# Altium schematic sheet MotionBoard.SchDoc
size A3; SheetNumber: 1; SheetTotal: 1
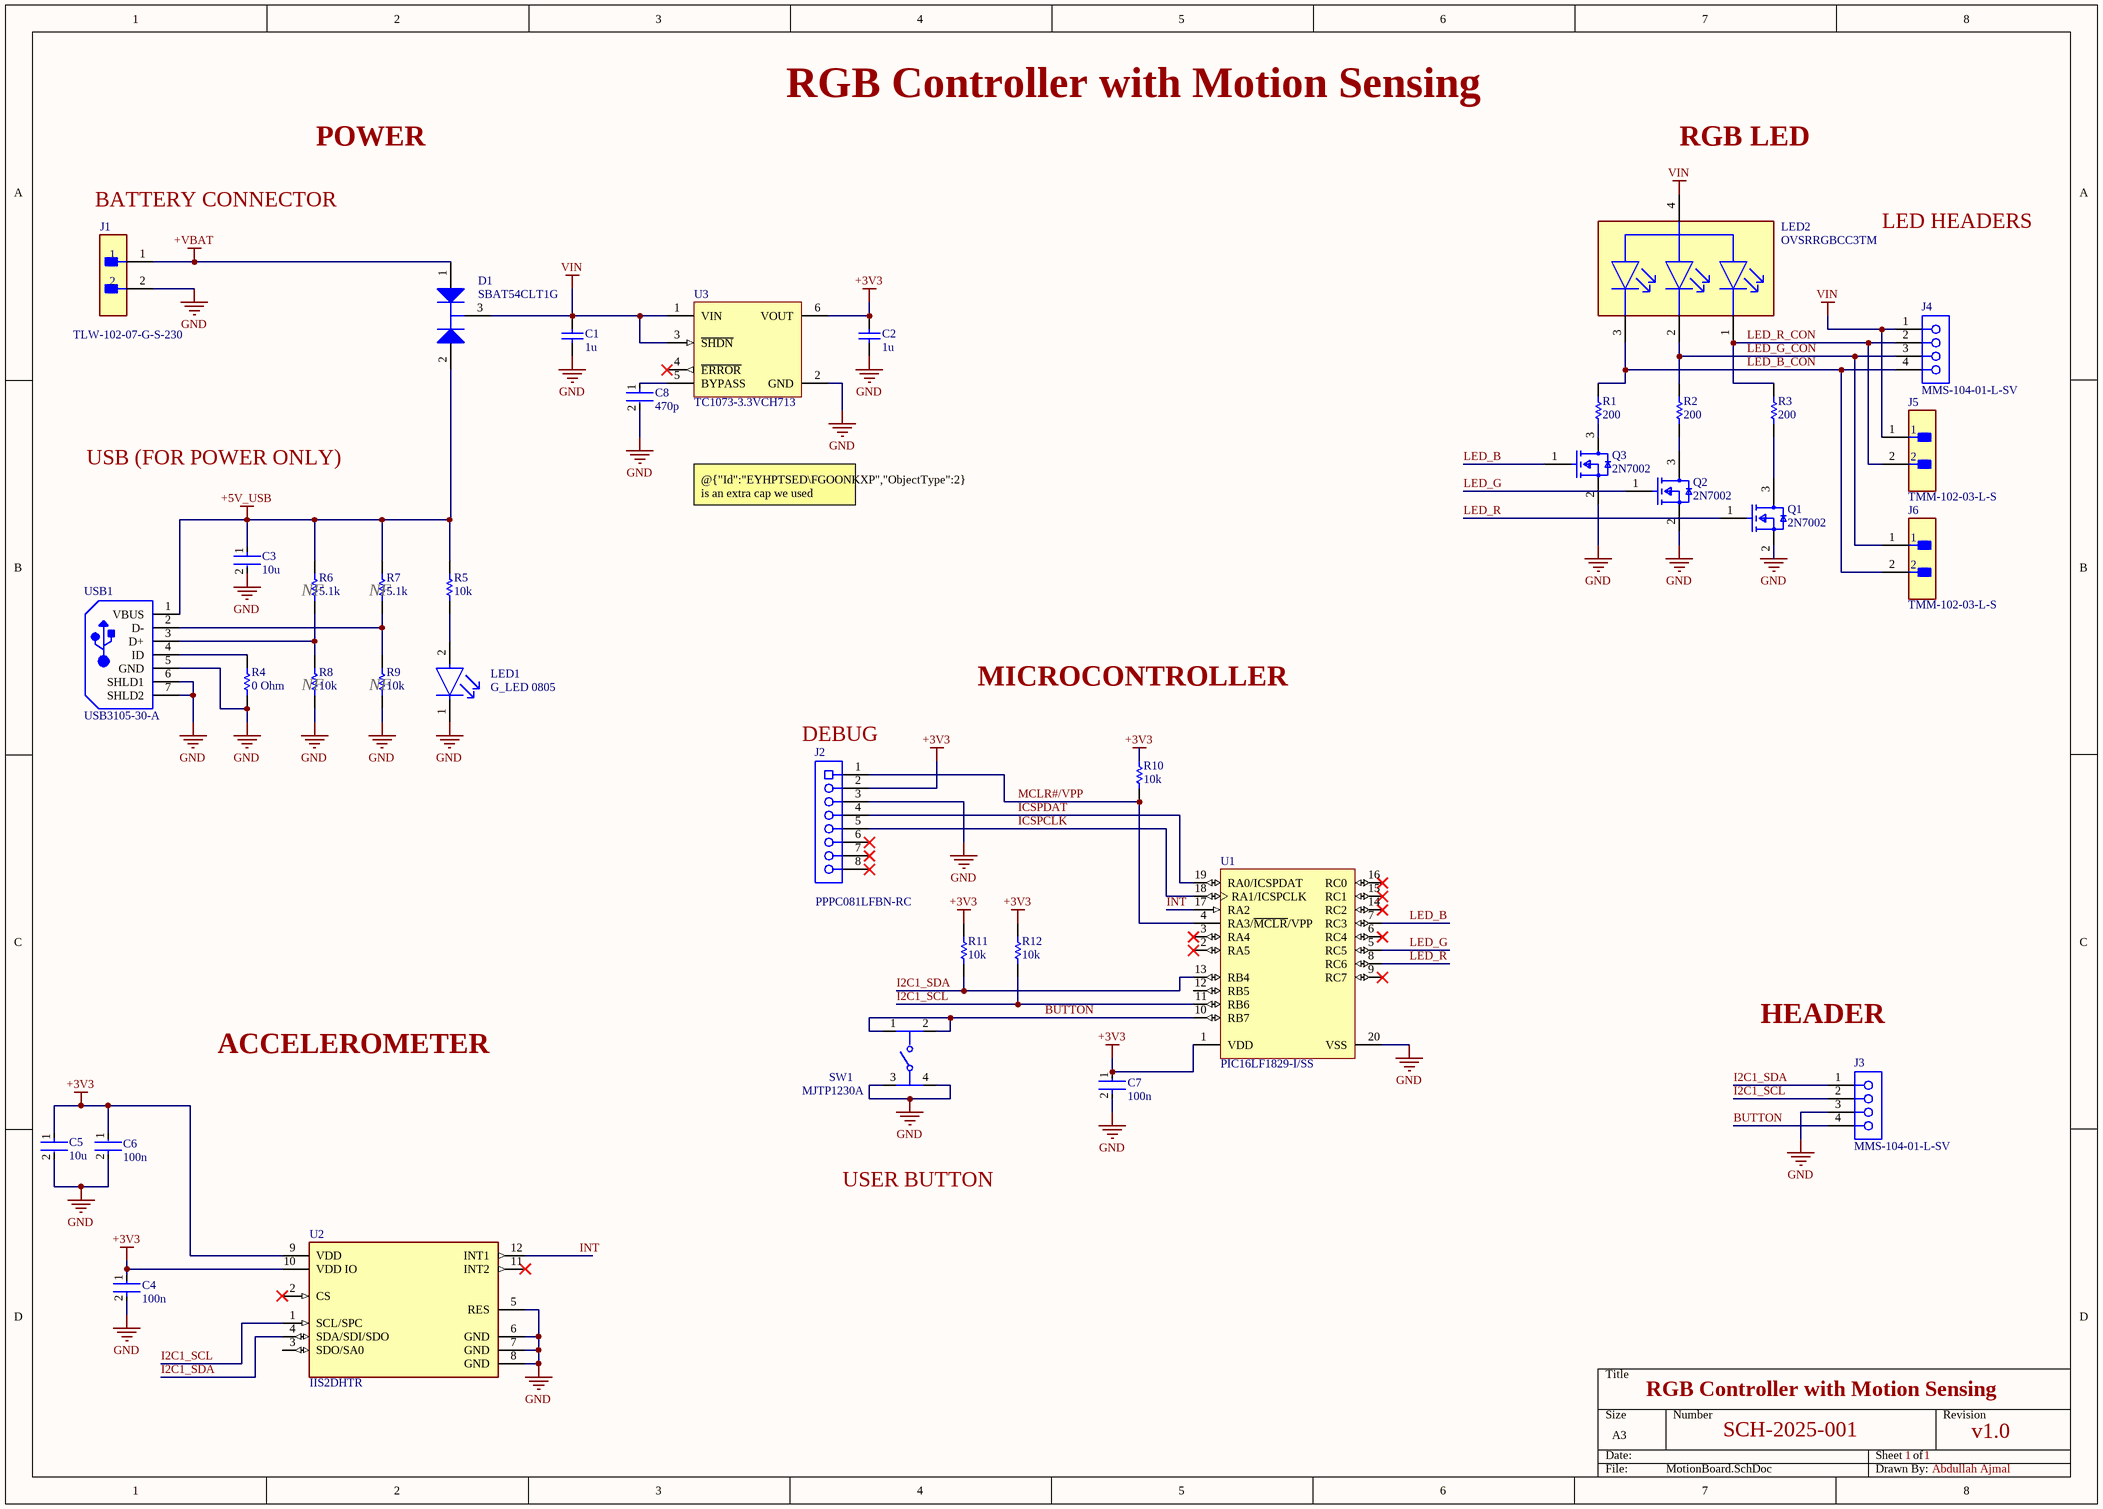
[diagram p0: MotionBoard.SchDoc]

## Parts
C1  1u  [CAPC2013X140X50NL20T25]
C2  1u  [CAPC2013X140X50NL20T25]
C3  10u  [FP-GRM188-0_2-MFG]
C4  100n  [FP-AC1210-0_85-MFG]
C5  10u  [FP-GRM188-0_2-MFG]
C6  100n  [FP-AC1210-0_85-MFG]
C7  100n  [FP-AC1210-0_85-MFG]
C8  470p  [FP-C0402-BB-MFG]
D1  SBAT54CLT1G  [ONSC-SOT-23-3-318-08_V]
J1  TLW-102-07-G-S-230  [FP-MTLW-102-07-G-S-230-MFG]
J2  PPPC081LFBN-RC  [SLIN-PPPC081LFBN-RC_V]
J3  MMS-104-01-L-SV  [SMTC-MMS-104-01-X-SV]
J4  MMS-104-01-L-SV  [SMTC-MMS-104-01-X-SV]
J5  TMM-102-03-L-S  [FP-TMM-102-03-L-S-MFG]
J6  TMM-102-03-L-S  [FP-TMM-102-03-L-S-MFG]
LED1  G_LED 0805  [FP-LG_R971-MFG]
LED2  OVSRRGBCC3TM  [FP-OVSRRGBCC3TM-MFG]
Q1  2N7002  [FP-PG-SOT23-3-MFG]
Q2  2N7002  [FP-PG-SOT23-3-MFG]
Q3  2N7002  [FP-PG-SOT23-3-MFG]
R1  200  [RESC3225X60X45ML20T20]
R2  200  [RESC3225X60X45ML20T20]
R3  200  [RESC3225X60X45ML20T20]
R4  0 Ohm  [RESC3116X65X45LL15T20]
R5  10k  [RESC1005X40X20NL05T10]
R6  5.1k  [RESC1005X35X20LL05T10]
R7  5.1k  [RESC1005X35X20LL05T10]
R8  10k  [RESC1005X40X20NL05T10]
R9  10k  [RESC1005X40X20NL05T10]
R10  10k  [RESC1005X40X20NL05T10]
R11  10k  [RESC1005X40X20NL05T10]
R12  10k  [RESC1005X40X20NL05T10]
SW1  MJTP1230A  [FP-MJTP1230A-MFG]
U1  PIC16LF1829-I/SS  [MCHP-SSOP-SS20_L]
U2  IIS2DHTR  [FP-LGA-12-8365767-MFG]
U3  TC1073-3.3VCH713  [SOT-23-CH6_M]
USB1  USB3105-30-A  [GCT-USB3105-30-A_V]

## Nets
+3V3: C2.2 C4.1 C5.1 C6.1 C7.1 J2.2 R10.2 R11.2 R12.2 U1.1(VDD) U2.9(VDD) U2.10(VDD_IO) U3.6(VOUT)
+5V_USB: C3.1 D1.2(A2) R5.2 R6.2 R7.2 USB1.1(VBUS)
+VBAT: D1.1(A1) J1.1
GND: C1.1 C2.1 C3.2 C4.2 C5.2 C6.2 C7.2 C8.2 J1.2 J2.3 J3.3 LED1.1(C) Q1.2(source) Q2.2(source) Q3.2(source) R4.1 R8.1 R9.1 SW1.3 SW1.4 U1.20(VSS) U2.5(RES) U2.6(GND) U2.7(GND) U2.8(GND) U3.2(GND) USB1.5(GND) USB1.6(SHLD1) USB1.7(SHLD2)
VIN: C1.2 D1.3(K) J4.1 J5.1 LED2.4(ANODE) U3.1(VIN) U3.3(~{SHDN})
BUTTON: J3.4 SW1.1 SW1.2 U1.10(RB7)
I2C1_SCL: J3.2 R12.1 U1.11(RB6) U2.1(SCL/SPC)
I2C1_SDA: J3.1 R11.1 U1.13(RB4) U2.4(SDA/SDI/SDO)
ICSPCLK: J2.5 U1.18(RA1/ICSPCLK)
ICSPDAT: J2.4 U1.19(RA0/ICSPDAT)
INT: U1.17(RA2) U2.12(INT1)
LED_B: Q3.1(gate) U1.7(RC3)
LED_B_CON: J4.4 J6.2 LED2.3(B) R1.2
LED_G: Q2.1(gate) U1.5(RC5)
LED_G_CON: J4.3 J6.1 LED2.2(G) R2.2
LED_R: Q1.1(gate) U1.8(RC6)
LED_R_CON: J4.2 J5.2 LED2.1(R) R3.2
MCLR#/VPP: J2.1 R10.1 U1.4(RA3/~{MCLR}/VPP)
NetC8_1: C8.1 U3.5(BYPASS)
NetLED1_2: LED1.2(A) R5.1
NetQ1_3: Q1.3(drain) R3.1
NetQ2_3: Q2.3(drain) R2.1
NetQ3_3: Q3.3(drain) R1.1
NetR4_2: R4.2 USB1.4(ID)
NetR6_1: R6.1 R8.2 USB1.3(D+)
NetR7_1: R7.1 R9.2 USB1.2(D-)

Not connected (* = marked no-connect by the designer): J2 6* 7* 8*; U1 2(RA5)* 3(RA4)* 6(RC4)* 9(RC7)* 12(RB5) 14(RC2)* 15(RC1)* 16(RC0)*; U2 2(CS)* 3(SDO/SA0) 11(INT2)*; U3 4(~{ERROR})*

## Notes on the sheet
- RGB Controller with Motion Sensing
- POWER
- RGB LED
- (near J1) BATTERY CONNECTOR
- LED HEADERS
- USB (FOR POWER ONLY)
- @{"Id":"EYHPTSED\FGOONKXP","ObjectType":2} is an extra cap we used
  KEEP NOTE
- (near R6) NF
- (near R7) NF
- (near R8) NF
- (near R9) NF
- MICROCONTROLLER
- (near J2) DEBUG
- ACCELEROMETER
- HEADER
- USER BUTTON
- SCH-2025-001
- 1
- v1.0
- Abdullah Ajmal

## Library data of the parts
C1 C2 = CMP-2007-03237-1: Part Number: C0805C105M4PACTU; Manufacturer: Kemet
C3 C5 = CMP-06035-009669-1: Chip Multilayer Ceramic Capacitors for General Purpose, 0603, 10uF, X5R, 15%, 20%, 16V / GRM188R61C106MA73J; Width: 800um; Capacitance: 10uF; Tolerance: 20%; Thickness: 800um; Dielectric: X5R; Length: 1.6mm; Voltage Rating (DC): 16V
C4 C6 C7 = CMP-03422-000642-1: CAP CER 0.1UF 100V X7R 1210 / AC1210KKX7R0BB104; Manufacturer: Yageo; Automotive Grade: Grade 1; Capacitance: 100 nF; Material: Ceramic; Value: 100 nF; Temperature Coefficient: 15%; Tolerance: 0.1; Automotive: Yes; ComponentLink2Description: Datasheet; Device Class L2: Capacitors; Height: 0.95mm; Manufacturer Part Number: AC1210KKX7R0BB104; Temperature: -55°C to +125°C; Voltage Rating: 100 V; Device Class L1: Passive Components; ComponentLink2URL: http://www.yageo.com/documents/recent/UPY-AC_NP0X7R_16V-to-630V_12.pdf; Lead Free: Yes; Category: Cap; Temperature Range High: +125°C; RoHS: TRUE; Digikey Description: CAP CER 0.1UF 100V X7R 1210; Temperature Range Low: -55°C; Octopart: https://octopart.com/ac1210kkx7r0bb104-yageo-78873719; Device Class L3: Ceramic Capacitors; Ipc Land Pattern Name: CAPC320250X85; Package: AC1210-0.85; Footprint Url: http://www.yageo.com/exep/pages/download/literatures/UPY-C_GEN_24.pdf; Temperature Characteristic: X7R
C8 = CMP-03020-005716-2: C0402 470 pF C0G 10.00% 16 V; Manufacturer: Kemet; Manufacturer Part Number: C0402C471K4GACAUTO; Voltage Rating: 16 V; Material: Ceramic; Tolerance: 0.1; Capacitance: 470 pF; Temperature Coefficient: 15%; Value: 470 pF; Height: 0.55mm; Ipc Land Pattern Name: CAPC10050X50; Temperature Range High: +125°C; Lead Free: Yes; Temperature: -55°C to +125°C; Device Class L3: Ceramic Capacitors; Category: Cap; Temperature Characteristic: C0G; Automotive: No; Temperature Range Low: -55°C; RoHS: TRUE; Package: C0402-BB; Octopart: https://octopart.com/c0402c471k4gacauto-kemet-48652786; ComponentLink2URL: https://content.kemet.com/datasheets/KEM_C1002_X7R_SMD.pdf; Device Class L1: Passive Components; Device Class L2: Capacitors; ComponentLink2Description: Datasheet
D1 = CMP-1055-00546-1: Dual Common Cathode Schottky Barrier Diodes, 3-Pin SOT-23, Pb-Free, Tape and Reel; Manufacturer: On Semiconductor; IFSM Max (A): 0.6; trr Max (ns): 5; DatasheetVersion: Rev. 8; PackageReference: SOT-23-3-318-08; ComponentLink2Description: Datasheet; ComponentLink2URL: http://www.onsemi.cn/pub_link/Collateral/BAT54CLT1-D.PDF; PartNumber: SBAT54CLT1G; Mounting Technology: Surface Mount; Configuration: Common Cathode; PackageDescription: 3-Pin Small Outline Transistor, Body 2.92 x 1.3 mm, Pitch 0.95 mm; RoHS: TRUE; ComponentLink3Description: Package Specification; ComponentLink3URL: http://www.onsemi.cn/pub_link/Collateral/318-08.PDF; Packing: Tape and Reel; PackageVersion: Rev. AP, 11/2009; ComponentLink1Description: Manufacturer URL; ComponentLink1URL: http://www.onsemi.com/
J1 = CMP-02766-001053-1: CONN HEADER VERT 2POS 2.54 / MMMTLW-102-07-G-S-230; Max Current Rating: 3A; Pitch: 2.54mm; Number of Contacts: 2; Gender: Male; Housing Color: Black; Housing Material: Polymer; Radiation Hardening: No; Min Operating Temperature: -55°C; Contact Plating: Gold; Termination: Solder; Number of Rows: 1; Max Operating Temperature: 125°C; Contact Material: Bronze; Depth: 2.48mm; Length: 5.08mm; Orientation: Straight; Packaging: Bulk
J2 = CMP-002-00028-2: Female Header, Pitch 2.54 mm, 1 x 8 Position, Height 8.5 mm, Tail Length 3.2 mm, -40 to 105 degC, RoHS, Bulk; Manufacturer: Sullins; Package Reference: PPPC081LFBN-RC; Connector Type: Header; Datasheet Version: Jan-15; Package Description: Female Header, Pitch 2.54 mm, 1 x 8 Position, Height 8.5 mm, Tail Length 3.2 mm; RoHS Compliant: Unknown; Max Operating Temperature: 105°C; Case/Package: PPPC081LFBN-RC; Min Operating Temperature: -40°C; Datasheet URL: http://sullinscorp.com/catalogs/101_PAGE114-115_.100_FEMALE_HDR.pdf; Gender: Female; Mounting Technology: TH
J3 J4 = CMP-1022-00067-1: Tiger Claw(TM) Socket Strip, Through-hole, Vertical, -55 to 125 degC, 2 mm Pitch, 4-Pin, Female, RoHS; Manufacturer: Samtec; Pitch: 2 mm; Orientation: Vertical; Mounting Technology: Through-hole; PackageVersion: AO, 2/1993; PartNumber: MMS-104-01-L-SV; ComponentLink1URL: http://www.samtec.com; ComponentLink3Description: Package Specification; ComponentLink2Description: Datasheet; PackageDescription: 2mm Through Hole Box Connector Strip Assembly; RoHS: True; DatasheetVersion: F-214; Temperature Range: -55 to 125 degC; ComponentLink3URL: http://www.samtec.com/documents/webfiles/cpdf/MMS-1XX-01-XXX-XX-XXX-MKT1.pdf; ComponentLink1Description: Manufacturer URL; ComponentLink2URL: http://www.samtec.com/documents/webfiles/pdf/MMS.PDF; PackageReference: MMS-104-01-X-SV
J5 J6 = CMP-02766-001502-1: CONN HEADER 2POS SNGL 2MM T/H; Gender: Male; Max Voltage Rating (AC): 500V; Number of Positions: 2; Max Current Rating: 3.9A; Insulation Material: Polymer; Lead Free: Lead Free; Termination: Solder; Contact Type: Male Pin; Number of Rows: 1; Min Operating Temperature: -55°C; Orientation: Straight; Insulation Color: Black; Depth: 1.97mm; Contact Plating: Gold; Housing Material: Polymer; Max Operating Temperature: 125°C; Fastening Type: Pull; Housing Color: Black; Series: TMM; Pitch: 2mm; Packaging: Bulk; Number of Contacts: 2; Radiation Hardening: No; Contact Material: Bronze; RoHS Compliant: Yes; Connector Type: Header; Length: 4mm; Contact Shape: Square; Mount: Through Hole; Package Quantity: 1; Color: Black; Contact Finish - Mating: GOLD; Contact Mating Length: 0.157inch; REACH SVHC: No SVHC
LED1 = CMP-62016-000039-1: LED GREEN DIFFUSED 0805 SMD / Q62702P5179; Test Current: 20mA; Power Dissipation: 65mW; Number of LEDs: 1; Viewing Angle: 160°; Lens Color: White; Lens Size: 1.25mm; Forward Voltage: 2.2V; Reverse Voltage: 12V; Forward Current: 25mA; Luminous Intensity: 45mcd; Luminous Flux: 0.1lm; Dominant Wavelength: 570nm; Min Operating Temperature: -30°C; Packaging: Tape and Reel; Radiation Hardening: No; Number of Pins: 2; Case Code (Imperial): 0805; Lens Style: Diffused; Mount: Surface Mount; Package Quantity: 1; Case Code (Metric): 2012; Color: Green; Case/Package: 0805; Width: 1.25mm; Illumination Color: Green; Lens Transparency: Diffused; Max Operating Temperature: 85°C; Number of Elements: 1; Depth: 1.35mm; Height: 0.9mm; Length: 2.1mm
LED2 = CMP-70659-000001-1: LED RGB DIFFUSED 1204 SMD; Color: Blue; Dominant Wavelength: 475nm; Lens Style: Dome; Luminous Intensity: 200mcd; Forward Voltage: 3.3V; Viewing Angle: 150°; Test Current: 20mA; Lens Color: White; Width: 1mm; Series: -; Case/Package: SMD/SMT; Packaging: Cut Tape; RoHS Compliant: Yes; Lens Transparency: Diffused; REACH SVHC: No SVHC; Lead Free: Lead Free; Length: 3.2mm; Height: 1.5mm; Mount: Surface Mount
Q1-Q3 = CMP-32901-000180-1: MOSFET N-CH 60V 0.3A SOT23 / 2N7002H6327XTSA2; Rise Time: 3.3ns; Input Capacitance: 20pF; Rds On Max: 3R; Gate to Source Voltage (Vgs): 20V; Continuous Drain Current (ID): 300mA; Max Power Dissipation: 500mW; Packaging: Tape and Reel; Mount: Surface Mount; Case/Package: SOT-23; Drain to Source Voltage (Vdss): 60V; Min Operating Temperature: -55°C; Halogen Free: Halogen Free; Max Dual Supply Voltage: 60V; Number of Pins: 3; Lead Free: Lead Free; Max Operating Temperature: 150°C
R1-R3 = CMP-2005-00653-1: CRCW1210200RJNTA; Manufacturer: Vishay Dale; Part Number: CRCW1210200RJNTA
R4 = CMP-2000-07493-1: Chip Resistor, 0 Ohm, +/- 0%, 0.25 W, -55 to 155 degC, 1206 (3216 Metric), RoHS, Tape and Reel / CRG1206ZR; Manufacturer: TE Connectivity; Number of Resistors: 1; Power Rating: 250mW; Resistance: 0mOhm; Temperature Coefficient: 100ppm\/degreesC; Voltage Rating: 200V; Case\/Package: 1206; Max Operating Temperature: 125degC; RoHSCompliant: true; Case Code (Imperial): 1206; Mounting Technology: SurfaceMount; ELV: Compliant; Min Operating Temperature: -55degC; Number of Terminations: 2; Tolerance: 0%; Package Quantity: 5000; Depth: 1.55mm; Height: 0.55mm; Datasheet URL: http://www.te.com/commerce/DocumentDelivery/DDEController?Action=showdoc&DocId=Customer+Drawing%7F1623693%7FBA%7Fpdf%7FEnglish%7FENG_CD_1623693_BA.pdf%7F1623693-1; Manufacturer URL: http://www.te.com/; Package Reference: RESC3116X65X45L15T20; Termination: Solder; Datasheet Version: Rev. BA, 12/2009; Package Description: 2-Pin Chip Resistor, Body 3.1 x 1.55 mm; Length: 3.1mm; Case Code (Metric): 3216; Radiation Hardening: No; Packaging: TapeandReel; Weight: 0.000571oz; Composition: ThickFilm; Width: 1.55mm; Mount: SurfaceMount
R5 R8-R12 = CMP-2002-01682-1: TNPW040210K0DEED; Manufacturer: Vishay BCcomponents; Part Number: TNPW040210K0DEED
R6 R7 = CMP-2002-03342-1: CPF0402B5K1E1; Manufacturer: TE Connectivity / AMP; Part Number: CPF0402B5K1E1
SW1 = CMP-47024-000004-1: SWITCH TACTILE SPST-NO 0.05A 12V; Mechanical Life: 100000Cycles; Throw Configuration: SPST; Actuator Length: 1.4mm; Switch Travel: 0.25mm; Actuator Color: Black; Operating Force: 160gf; Contact Resistance: 100mR; Actuator Type: Standard; Switch Function: Off-Mom; Actuator Material: Thermoplastic; Illumination Type: Non-Illuminated; Current Rating: 50mA; Min Operating Temperature: -20°C; Series: MJTP; Electrical Life: 100000Cycles; Mount: Through Hole; Packaging: Bulk; Color: Black; Package Quantity: 2000; Voltage Rating (DC): 12V; REACH SVHC: No SVHC; Orientation: Straight; Termination: PC Pin; Contact Material: Bronze; RoHS Compliant: Yes; Max Voltage Rating (DC): 12V; Max Operating Temperature: 70°C; Contact Plating: Silver
U1 = CMP-0115-02781-1: Flash Microcontroller with XLP Technology, 32 MHz, 17 I/O, -40 to 85 degC, 20-pin SSOP (SS20), Tube; Manufacturer: Microchip; Program Memory KWords: 8; Max. CPU Speed MHz: 32; # of A/D Channels: 12; Digital Communication: 1 -A/E/USART, 2 -MSSP(SPI/I2C); Internal Oscillator: 32 MHz, 31 kHz; Program Memory KBytes: 14; Timers: 4 - 8-bit, 1 - 16-bit, 0 - 32-bit; EEPROM Data Memory (bytes): 256; Operation Voltage Range: 1.8V - 3.6V; I/O Pins: 17; RAM: 1024; Mounting Technology: Surface Mount; PackageReference: SSOP-SS20; PartNumber: PIC16LF1829-I/SS; ComponentLink3URL: Product URL:http://www.microchip.com/wwwproducts/Devices.aspx?dDocName=en546919; ComponentLink1Description: Datasheet; DatasheetVersion: Rev. C; ComponentLink2Description: Package Specification; Memory Type: Flash; ComponentLink1URL: http://ww1.microchip.com/downloads/en/DeviceDoc/41440C.pdf; PackageDescription: 20-Lead Plastic Shrink Small Outline, 5.3 x 7.2 mm Body, 0.65 mm Pitch; Packing: TUBE; ComponentLink3Description: URL Link1; PackageVersion: C04-072B, 12/2012; ComponentLink2URL: http://www.microchip.com/stellent/groups/techpub_sg/documents/packagingspec/en012702.pdf
U2 = CMP-12175-000008-1: ACCEL 2-16G I2C/SPI 12LGA; Manufacturer: STMicroelectronics; Operating Supply Current: 2-11uA; Max Supply Voltage: 3.7V; Accel Axis: X+Y and Z; Sensor Output: I2C,SPI; Min Supply Voltage: 1.71V; Accel Range: 2/4/8/16g; Height: 1mm; Device Class L1: Sensors; Manufacturer Part Number: IIS2DHTR; Temperature Range High: +85°C; ComponentLink2Description: Datasheet; Automotive: No; Temperature Range Low: -40°C; Package: LGA-12-8365767; Octopart: https://octopart.com/iis2dhtr-stmicroelectronics-58218805; Digikey Description: ACCEL 2-16G I2C/SPI 12LGA; ComponentLink2URL: https://www.st.com/content/ccc/resource/technical/document/datasheet/group1/35/6d/04/26/27/5c/4d/7c/DM00171283/files/DM00171283.pdf/jcr:content/translations/en.DM00171283.pdf; Temperature: -40°C to +85°C; Category: IC; RoHS: TRUE; Device Class L3: Accelerometers; Lead Free: Yes; Device Class L2: Motion Sensors
U3 = CMP-0136-00636-1: 50mA and 100mA CMOS LDOs with Shutdown, Active-Low Error Output and VREF Bypass, 6-Pin SOT-23, Extended Temperature, Tape and Reel; Code_IPC: SOT26A-6; PackageDescription: 6-Lead Plastic Small Outline Transistor (CH) [SOT-23]; DatasheetVersion: revD, Feb-2007; PackageReference: SOT-23-CH6; PackageVersion: revBB, Aug-2009
USB1 = CMP-2000-07366-1: USB 2.0 A/B Receptacle, 30 V, -55 to 85 degC, 5-Pin THD, RoHS, Tape and Reel; Manufacturer: Global Connector Technology; USB Standard: USB2.0; Connector Mounting: ThroughHoleMount; USB Connector Type: MicroUSBTypeAB; No. of Positions: 5Ways; Product Range: -; Package Description: 5-Pin Through Hole Device, Body 7.96 x 2.9 mm, Pitch 0.65 mm; Package Reference: USB3105-30-A; Gender: Receptacle; Datasheet URL: http://gct.co/usb-connectors/pdf/USB3105.pdf; Mounting Technology: ThroughHole; Orientation: Vertical; Contact Material: CopperAlloy; Contact Plating: GoldPlatedContacts; Manufacturer URL: http://gct.co/; Datasheet Version: Rev. F, 05/2015